# EAGLE design scartboard (EAGLE 6.0)
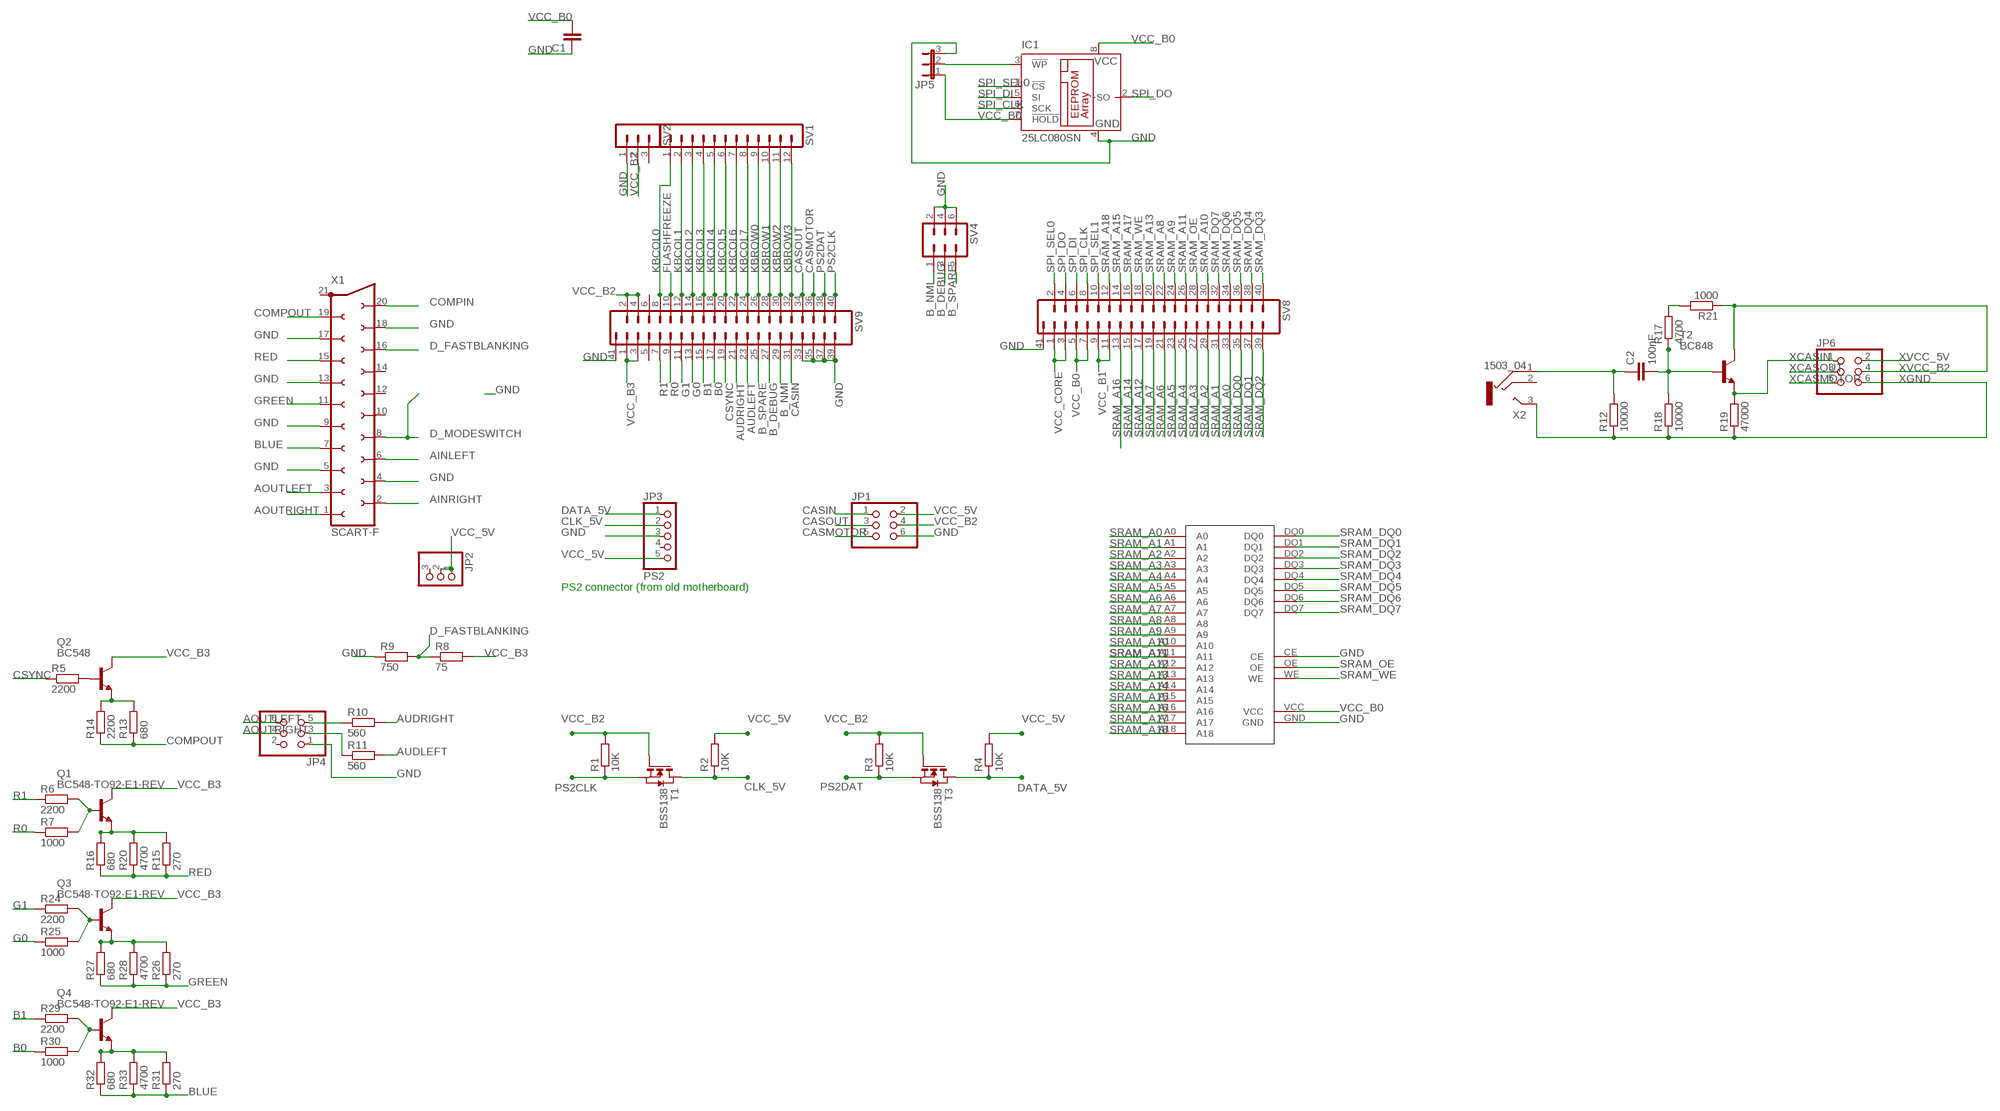
[diagram p0: schematic, sheet 1]

## Parts
C1  C-EUC0603  [C0603]
C2  100nF  C-EUC0603  [C0603]
IC1  25LC080SN  [SO-08]
JP1  PINHD-2X3  [2X03]
JP2  PINHD-1X3  [1X03]
JP3  PS2  PINHD-1X5  [1X05]
JP4  PINHD-2X3  [2X03]
JP5  JP2E  [JP2]
JP6  PINHD-2X3  [2X03]
Q1  BC548-TO92-E1-REV  [TO92-E1-REV]
Q2  BC548  [TO92-EBC]
Q3  BC548-TO92-E1-REV  [TO92-E1-REV]
Q4  BC548-TO92-E1-REV  [TO92-E1-REV]
R1  10K  R-EU_R0805  [R0805]
R2  10K  R-EU_R0805  [R0805]
R3  10K  R-EU_R0805  [R0805]
R4  10K  R-EU_R0805  [R0805]
R5  2200  R-EU_R0805  [R0805]
R6  2200  R-EU_R0805  [R0805]
R7  1000  R-EU_R0805  [R0805]
R8  75  R-EU_R0805  [R0805]
R9  750  R-EU_R0805  [R0805]
R10  560  R-EU_R0805  [R0805]
R11  560  R-EU_R0805  [R0805]
R12  10000  R-EU_R0805  [R0805]
R13  680  R-EU_R0805  [R0805]
R14  2200  R-EU_R0805  [R0805]
R15  270  R-EU_R0805  [R0805]
R16  680  R-EU_R0805  [R0805]
R17  4700  R-EU_R0805  [R0805]
R18  10000  R-EU_R0805  [R0805]
R19  47000  R-EU_R0805  [R0805]
R20  4700  R-EU_R0805  [R0805]
R21  1000  R-EU_R0805  [R0805]
R24  2200  R-EU_R0805  [R0805]
R25  1000  R-EU_R0805  [R0805]
R26  270  R-EU_R0805  [R0805]
R27  680  R-EU_R0805  [R0805]
R28  4700  R-EU_R0805  [R0805]
R29  2200  R-EU_R0805  [R0805]
R30  1000  R-EU_R0805  [R0805]
R31  270  R-EU_R0805  [R0805]
R32  680  R-EU_R0805  [R0805]
R33  4700  R-EU_R0805  [R0805]
SV1  MA12-1  [MA12-1]
SV2  MA03-1  [MA03-1]
SV4  MA03-2  [MA03-2]
SV8  ACTEL_HDR  [ACTEL_HDR]
SV9  ACTEL_HDR  [ACTEL_HDR]
T1  BSS138  NMOSSOT23  [SOT-23]
T2  BC848  [SOT23]
T3  BSS138  NMOSSOT23  [SOT-23]
U$1  AS6C4008  [SOP32]
X1  SCART-F  [SCART-F]
X2  1503_04  [1503_04]

## Nets
AINLEFT: X1.6
AINRIGHT: X1.2
AOUTLEFT: JP4.6 X1.3
AOUTRIGHT: JP4.4 X1.1
AUDLEFT: R11.2 SV9.23
AUDRIGHT: R10.2 SV9.21
B0: R30.1 SV9.17
B1: R29.1 SV9.15
B_DEBUG: SV4.3 SV9.27
B_NMI: SV4.1 SV9.29
B_SPARE: SV4.5 SV9.25
BLUE: R31.1 R32.1 R33.1 X1.7
CASIN: JP1.1 SV9.31
CASMOTOR: JP1.5 SV9.36
CASOUT: JP1.3 SV9.34
CLK_5V: JP3.2 R2.1 T1.1(D)
COMPIN: X1.20
COMPOUT: R13.1 R14.1 X1.19
CSYNC: R5.1 SV9.19
D_FASTBLANKING: R8.1 R9.2 X1.16
D_MODESWITCH: X1.8
DATA_5V: JP3.1 R4.1 T3.1(D)
FLASHFREEZE: SV9.10
G0: R25.1 SV9.13
G1: R24.1 SV9.11
GND: C1.1 IC1.4(GND) JP1.6 JP3.3 JP4.1 JP5.3 R9.1 SV2.1 SV4.2 SV4.4 SV4.6 SV8.41 SV9.33 SV9.35 SV9.37 SV9.39 SV9.41 U$1.CE U$1.GND X1.4 X1.5 X1.9 X1.13 X1.17 X1.18
GREEN: R26.1 R27.1 R28.1 X1.11
KBCOL0: SV1.1 SV9.8
KBCOL1: SV1.2 SV9.12
KBCOL2: SV1.3 SV9.14
KBCOL3: SV1.4 SV9.16
KBCOL4: SV1.5 SV9.18
KBCOL5: SV1.6 SV9.20
KBCOL6: SV1.7 SV9.22
KBCOL7: SV1.8 SV9.24
KBROW0: SV1.9 SV9.26
KBROW1: SV1.10 SV9.28
KBROW2: SV1.11 SV9.30
KBROW3: SV1.12 SV9.32
N$1: Q2.E R13.2 R14.2
N$2: Q1.2(B) R6.2 R7.2
N$3: Q2.B R5.2
N$4: JP4.5 R10.1
N$5: JP4.3 R11.1
N$6: Q1.3(E) R15.2 R16.2 R20.2
N$7: IC1.3(!WP) JP5.2
N$8: C2.2 R17.1 R18.2 T2.1(B)
N$9: Q3.2(B) R24.2 R25.2
N$10: Q3.3(E) R26.2 R27.2 R28.2
N$11: Q4.2(B) R29.2 R30.2
N$12: Q4.3(E) R31.2 R32.2 R33.2
N$13: R17.2 R21.2
N$14: C2.1 R12.2 X2.1
PS2CLK: R1.1 SV9.40 T1.2(S)
PS2DAT: R3.1 SV9.38 T3.2(S)
R0: R7.1 SV9.9
R1: R6.1 SV9.7
RED: R15.1 R16.1 R20.1 X1.15
SPI_CLK: IC1.6(SCK) SV8.8
SPI_DI: IC1.5(SI) SV8.6
SPI_DO: IC1.2(SO) SV8.4
SPI_SEL0: IC1.1(!CS) SV8.2
SPI_SEL1: SV8.10
SRAM_A0: SV8.33 U$1.A0
SRAM_A1: SV8.31 U$1.A1
SRAM_A2: SV8.29 U$1.A2
SRAM_A3: SV8.27 U$1.A3
SRAM_A4: SV8.25 U$1.A4
SRAM_A5: SV8.23 U$1.A5
SRAM_A6: SV8.21 U$1.A6
SRAM_A7: SV8.19 U$1.A7
SRAM_A8: SV8.22 U$1.A8
SRAM_A9: SV8.24 U$1.A9
SRAM_A10: SV8.30 U$1.A10
SRAM_A11: SV8.26 U$1.A11
SRAM_A12: SV8.17 U$1.A12
SRAM_A13: SV8.20 U$1.A13
SRAM_A14: SV8.15 U$1.A14
SRAM_A15: SV8.14 U$1.A15
SRAM_A16: SV8.13 U$1.A16
SRAM_A17: SV8.16 U$1.A17
SRAM_A18: SV8.12 U$1.A18
SRAM_DQ0: SV8.35 U$1.DQ0
SRAM_DQ1: SV8.37 U$1.DQ1
SRAM_DQ2: SV8.39 U$1.DQ2
SRAM_DQ3: SV8.40 U$1.DQ3
SRAM_DQ4: SV8.38 U$1.DQ4
SRAM_DQ5: SV8.36 U$1.DQ5
SRAM_DQ6: SV8.34 U$1.DQ6
SRAM_DQ7: SV8.32 U$1.DQ7
SRAM_OE: SV8.28 U$1.OE
SRAM_WE: SV8.18 U$1.WE
VCC_5V [power]: JP1.2 JP2.1 JP2.2 JP3.5 R2.2 R4.2
VCC_B0: C1.2 IC1.7(!HOLD) IC1.8(VCC) JP5.1 SV8.5 SV8.7 U$1.VCC
VCC_B1: SV8.9 SV8.11
VCC_B2: JP1.4 R1.2 R3.2 SV2.2 SV9.2 SV9.4 T1.3(G) T3.3(G)
VCC_B3: Q1.1(C) Q2.C Q3.1(C) Q4.1(C) R8.2 SV9.1 SV9.3
VCC_CORE: SV8.1 SV8.3
XCASIN: JP6.1 R19.2 T2.2(E)
XCASMOTOR: JP6.5
XCASOUT: JP6.3
XGND: JP6.6 R12.1 R18.1 R19.1 X2.3
XVCC_5V: JP6.2
XVCC_B2: JP6.4 R21.1 T2.3(C)
Unconnected: JP2.3 JP3.4 JP4.2 SV2.3 SV9.5 SV9.6 X1.10 X1.12 X1.14 X1.21 X2.2

## Notes on the sheet
- PS2 connector (from old motherboard)

## Library data of the parts
C1 = rcl:C-EU: CAPACITOR, European symbol
C2 = resistor:C-EU: CAPACITOR, European symbol
IC1 = microchip:25*: Serial EEPROM 4K/ 8K , SPI bus; MF: MICROCHIP; MPN: 25LC080/SN; OC_FARNELL: 1137302; OC_NEWARK: 96K4092
JP1 JP4 JP6 = pinhead:PINHD-2X3: PIN HEADER
JP2 = pinhead:PINHD-1X3: PIN HEADER
JP3 = pinhead:PINHD-1X5: PIN HEADER
JP5 = jumper:JP2E: JUMPER
Q1 Q3 Q4 = bc548:BC548*: NPN Transistor
Q2 = transistor-npn:BC548*: NPN Transistor
R1-R21 R24-R33 = rcl:R-EU_: RESISTOR, European symbol
SV1 = con-lstb:MA12-1: PIN HEADER; OC_FARNELL: unknown; OC_NEWARK: unknown
SV2 = con-lstb:MA03-1: PIN HEADER; OC_FARNELL: unknown; OC_NEWARK: unknown
SV4 = con-lstb:MA03-2: PIN HEADER; OC_FARNELL: unknown; OC_NEWARK: unknown
SV8 SV9 = cpcfpga:ACTEL_HDR: PIN HEADER; OC_FARNELL: unknown; OC_NEWARK: unknown
T1 T3 = zetex:NMOSSOT23: MOS FET; OC_FARNELL: unknown; OC_NEWARK: unknown
T2 = transistor:BC848: NPN TRANSISTOR
U$1 = sram:AS6C4008: AS6C4008 static ram
X1 = con-hirschmann:SCART-F: TV SCART CONNECTOR; OC_FARNELL: unknown; OC_NEWARK: unknown
X2 = con-lumberg:1503_04: Jack connectors according to JISC 6560, 3.5 mm, IP 57 Klinkensteckverbinder nach JISC 6560, 3,5 mm, IP 57 Source: http://www.lumberg.com/Produkte/PDFs/1503_04.pdf; OC_FARNELL: 1216981; OC_NEWARK: unknown

## Net classes
0 default: width 0.2 mm, drill 1.1 mm, clearance 0.2 mm
1 power: width 0.6 mm, drill 1.1 mm, clearance 0.4 mm

## Board
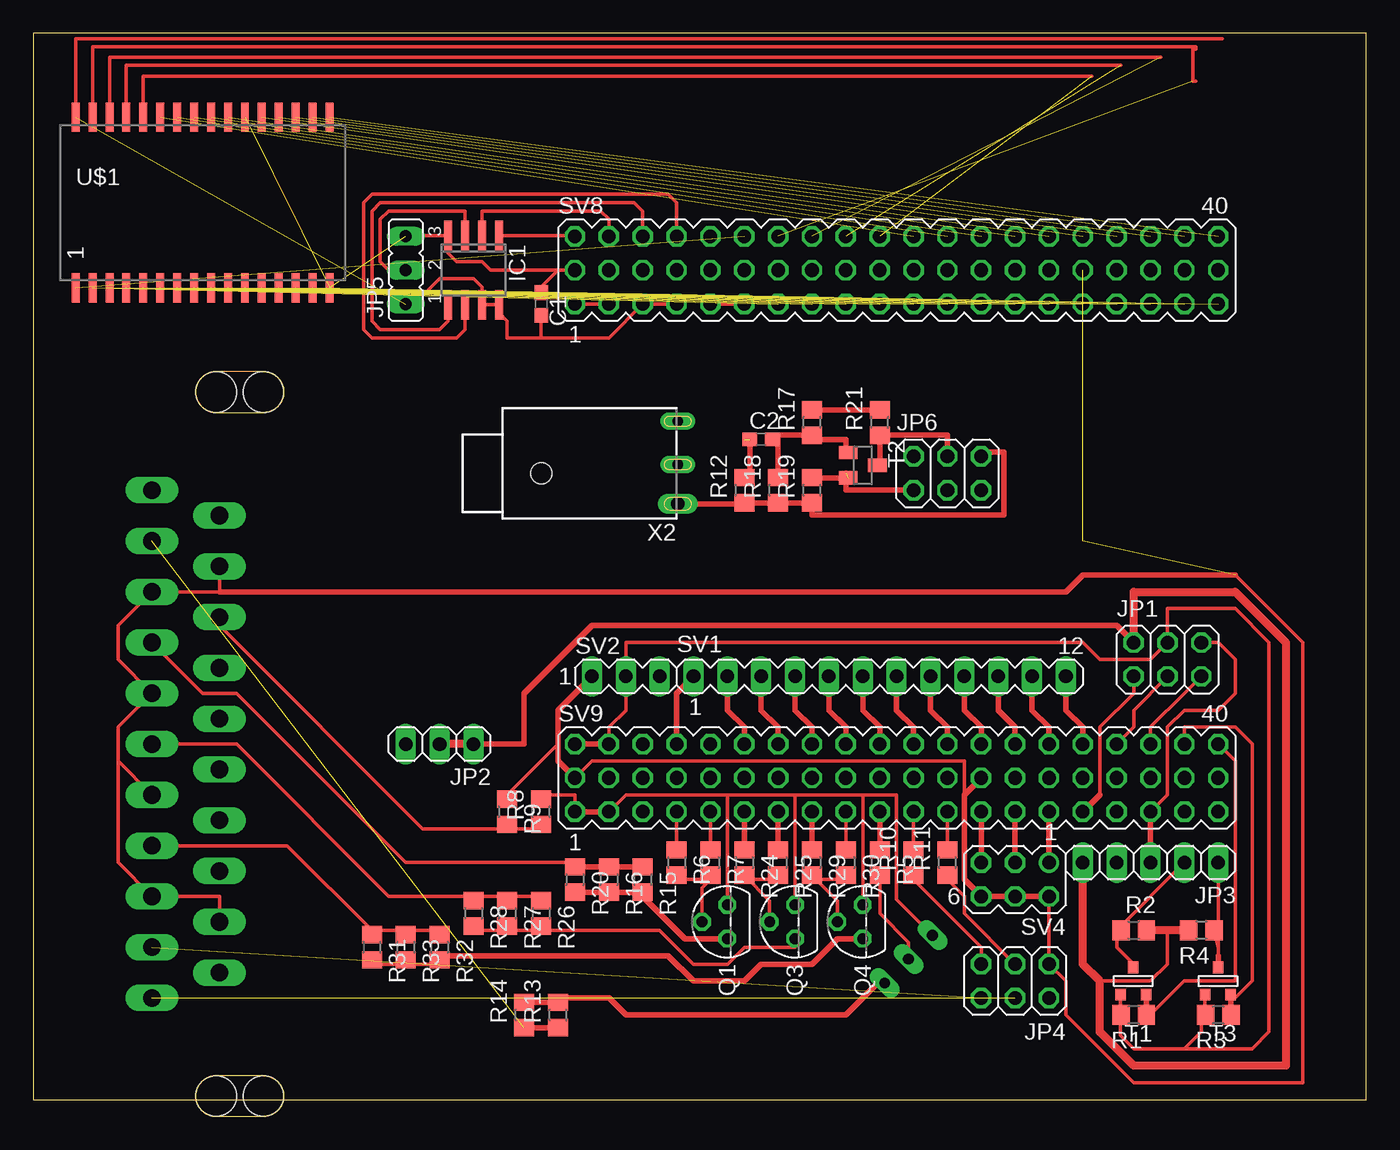
[diagram p1: board, top side]
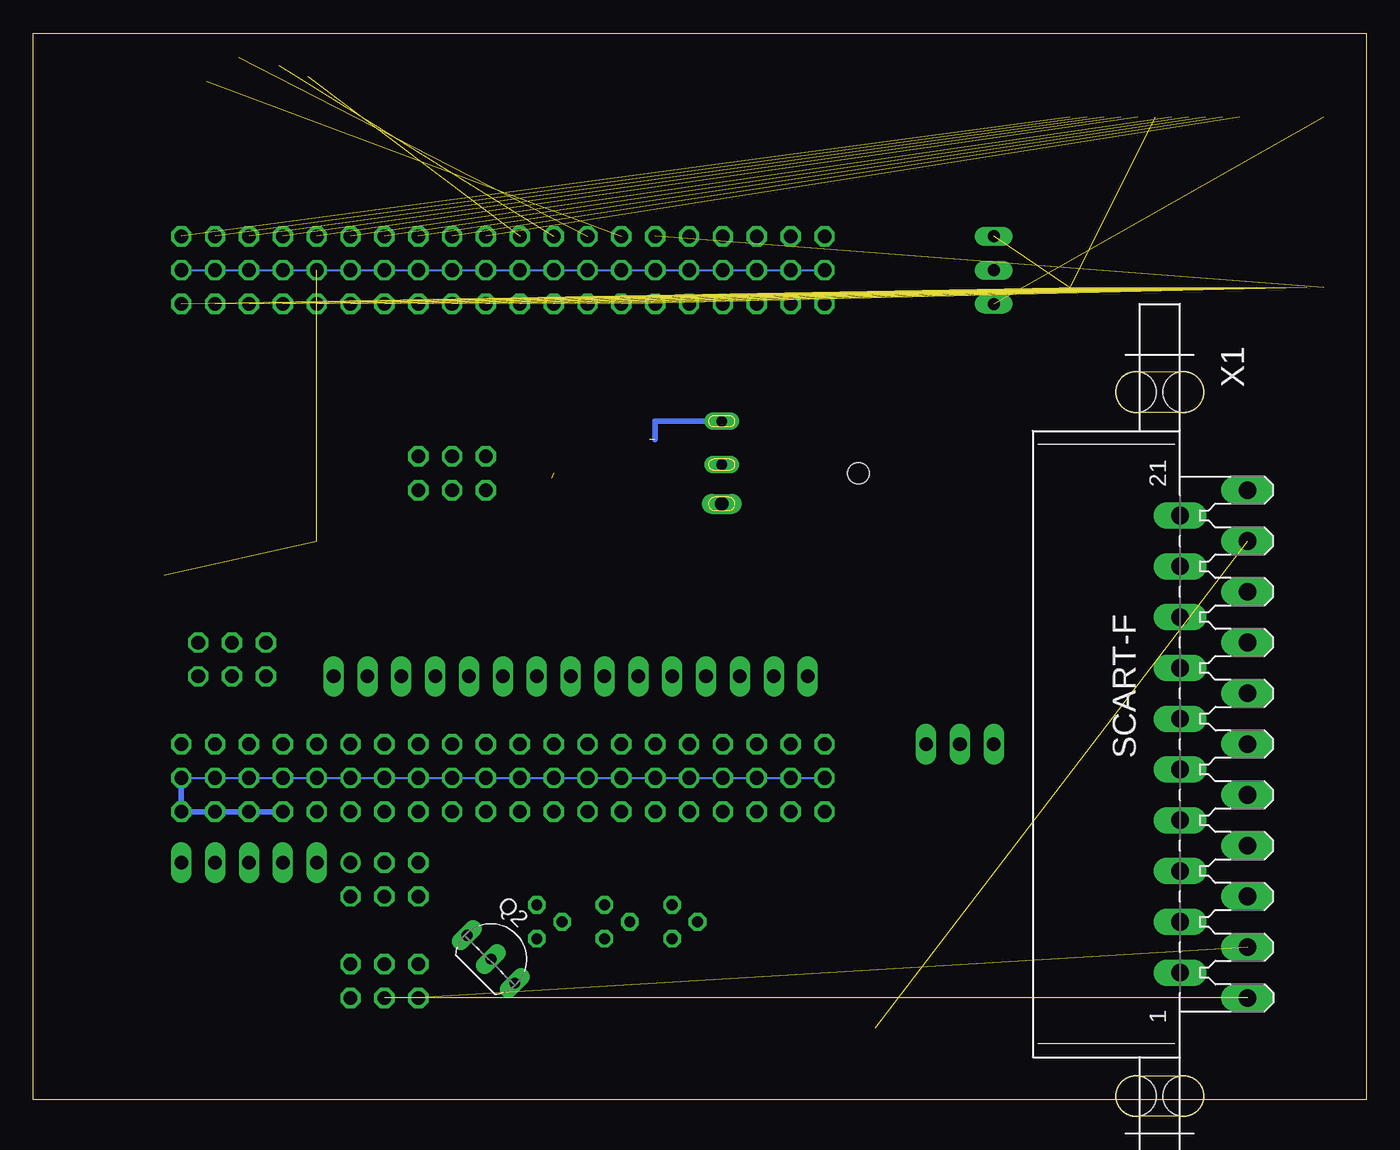
[diagram p2: board, bottom side, seen from below]

Size 100 x 80 mm. Coordinates in mm from the lower left corner, seen from the top.
Outline: 0,0 100,0 100,80 0,80 0,0
Copper layers (1*16): Top 0.035mm / dielectric 1.5mm / Bottom 0.035mm
Design rules: minimum track width 10mil, minimum drill 24mil, track to track 8mil, track to pad 8mil, pad to pad 8mil, via to via 8mil, smd to smd 8mil, copper to edge 40mil, drill to drill 8mil, minimum pad ring 10mil, minimum via ring 8mil, stop-mask expansion 4mil, vias tented up to drill 0mil, thermal gap 10mil

### Footprints (pad centres in the part's own frame; a part is rotated, then mirrored left to right if it is on the bottom)
C0603 = smd 1.1 x 1: 1 -0.85,0; 2 0.85,0
SO-08 = smd 0.6 x 2.2: 1 -1.905,-2.6; 2 -0.635,-2.6; 3 0.635,-2.6; 4 1.905,-2.6; 5 1.905,2.6; 6 0.635,2.6; 7 -0.635,2.6; 8 -1.905,2.6
2X03 = drill 1.016 octagon: 1 -2.54,-1.27; 2 -2.54,1.27; 3 0,-1.27; 4 0,1.27; 5 2.54,-1.27; 6 2.54,1.27
1X03 = drill 1.016 long: 1 -2.54,0; 2 0,0; 3 2.54,0
1X05 = drill 1.016 long: 1 -5.08,0; 2 -2.54,0; 3 0,0; 4 2.54,0; 5 5.08,0
JP2 = drill 0.914 long: 1 -2.54,0; 2 0,0; 3 2.54,0
TO92-E1-REV = drill 0.813 octagon: 1 -1.27,0; 2 0,-1.905; 3 1.27,0
TO92-EBC = drill 0.813 long: B 0,-1.27; C -2.54,-1.27; E 2.54,-1.27
R0805 = smd 1.3 x 1.5: 1 -0.95,0; 2 0.95,0
MA12-1 = drill 1.016 long: 1 -13.97,0; 2 -11.43,0; 3 -8.89,0; 4 -6.35,0; 5 -3.81,0; 6 -1.27,0; 7 1.27,0; 8 3.81,0; 9 6.35,0; 10 8.89,0; 11 11.43,0; 12 13.97,0
MA03-1 = drill 1.016 long: 1 -2.54,0; 2 0,0; 3 2.54,0
MA03-2 = drill 1.016: 1 -2.54,-1.27 | drill 1.016 octagon: 2 -2.54,1.27; 3 0,-1.27; 4 0,1.27; 5 2.54,-1.27; 6 2.54,1.27
ACTEL_HDR = drill 1.016 octagon: 1 -24.13,-2.54; 2 -24.13,2.54; 3 -21.59,-2.54; 4 -21.59,2.54; 5 -19.05,-2.54; 6 -19.05,2.54; 7 -16.51,-2.54; 8 -16.51,2.54; 9 -13.97,-2.54; 10 -13.97,2.54; 11 -11.43,-2.54; 12 -11.43,2.54; 13 -8.89,-2.54; 14 -8.89,2.54; 15 -6.35,-2.54; 16 -6.35,2.54; 17 -3.81,-2.54; 18 -3.81,2.54; 19 -1.27,-2.54; 20 -1.27,2.54; 21 1.27,-2.54; 22 1.27,2.54; 23 3.81,-2.54; 24 3.81,2.54; 25 6.35,-2.54; 26 6.35,2.54; 27 8.89,-2.54; 28 8.89,2.54; 29 11.43,-2.54; 30 11.43,2.54; 31 13.97,-2.54; 32 13.97,2.54; 33 16.51,-2.54; 34 16.51,2.54; 35 19.05,-2.54; 36 19.05,2.54; 37 21.59,-2.54; 38 21.59,2.54; 39 24.13,-2.54; 40 24.13,2.54; 41 -24.13,0; 42 -21.59,0; 43 -19.05,0; 44 -16.51,0; 45 -13.97,0; 46 -11.43,0; 47 -8.89,0; 48 -6.35,0; 49 -3.81,0; 50 -1.27,0; 51 1.27,0; 52 3.81,0; 53 6.35,0; 54 8.89,0; 55 11.43,0; 56 13.97,0; 57 16.51,0; 58 19.05,0; 59 21.59,0; 60 24.13,0
SOT-23 = smd 0.787 x 0.889: 1 0.025,-1.016; 2 -0.94,1.016; 3 0.991,1.016
SOT23 = smd 1 x 1.4: 1 -0.95,-1.1; 2 0.95,-1.1; 3 0,1.1
SOP32 = smd 0.6 x 2.2: A0 4.445,-6.4; A1 3.175,-6.4; A2 1.905,-6.4; A3 0.635,-6.4; A4 -0.635,-6.4; A5 -1.905,-6.4; A6 -3.175,-6.4; A7 -4.445,-6.4; A8 -3.175,6.4; A9 -1.905,6.4; A10 1.905,6.4; A11 -0.635,6.4; A12 -5.715,-6.4; A13 -4.445,6.4; A14 -6.985,-6.4; A15 -8.255,6.4; A16 -8.255,-6.4; A17 -6.985,6.4; A18 -9.525,-6.4; CE 3.175,6.4; DQ0 5.715,-6.4; DQ1 6.985,-6.4; DQ2 8.255,-6.4; DQ3 9.525,6.4; DQ4 8.255,6.4; DQ5 6.985,6.4; DQ6 5.715,6.4; DQ7 4.445,6.4; GND 9.525,-6.4; OE 0.635,6.4; VCC -9.525,6.4; WE -5.715,6.4
SCART-F = drill 1.321 long: 1 19.05,5.08; 2 17.145,0; 3 15.24,5.08; 4 13.335,0; 5 11.43,5.08; 6 9.525,0; 7 7.62,5.08; 8 5.715,0; 9 3.81,5.08; 10 1.905,0; 11 0,5.08; 12 -1.905,0; 13 -3.81,5.08; 14 -5.715,0; 15 -7.62,5.08; 16 -9.525,0; 17 -11.43,5.08; 18 -13.335,0; 19 -15.24,5.08; 20 -17.145,0; 21 -19.05,5.08 | hole 3.023: 26.416,0.254; 26.416,-3.302; -26.416,0.254; -26.416,-3.302
1503_04 = drill 0.8 pad 1.2 long: 1 3.9,-10.25; 2 0.65,-10.25 | drill 1 pad 1.2 long: 3 -2.3,-10.25 | hole 1.6: 0,0

### Placement (x,y rotation side)
C1  38.1,59.69 270 top
C2  54.61,49.53 0 top
IC1  33.02,62.23 180 top
JP1  85.09,33.02 0 top
JP2  30.48,26.67 180 top
JP3  83.82,17.78 180 top
JP4  73.66,8.89 180 top
JP5  27.94,62.23 90 top
JP6  68.58,46.99 0 top
Q1  52.07,13.34 270 top
Q2  64.77,11.43 315 bottom
Q3  57.15,13.34 270 top
Q4  62.23,13.34 270 top
R1  82.55,6.35 180 top
R2  82.55,12.7 0 top
R3  88.9,6.35 180 top
R4  87.63,12.7 180 top
R5  63.5,17.78 270 top
R6  48.26,17.78 270 top
R7  50.8,17.78 270 top
R8  38.1,21.59 90 top
R9  35.56,21.59 270 top
R10  66.04,17.78 90 top
R11  68.58,17.78 90 top
R12  53.34,45.72 90 top
R13  39.37,6.35 90 top
R14  36.83,6.35 90 top
R15  45.72,16.51 270 top
R16  43.18,16.51 270 top
R17  58.42,50.8 90 top
R18  55.88,45.72 90 top
R19  58.42,45.72 90 top
R20  40.64,16.51 270 top
R21  63.5,50.8 90 top
R24  53.34,17.78 270 top
R25  55.88,17.78 270 top
R26  38.1,13.97 270 top
R27  35.56,13.97 270 top
R28  33.02,13.97 270 top
R29  58.42,17.78 270 top
R30  60.96,17.78 270 top
R31  25.4,11.43 270 top
R32  30.48,11.43 270 top
R33  27.94,11.43 270 top
SV1  63.5,31.75 0 top
SV2  44.45,31.75 0 top
SV4  73.66,16.51 180 top
SV8  64.77,62.23 0 top
SV9  64.77,24.13 0 top
T1  82.55,8.89 180 top
T2  62.23,47.59 270 top
T3  88.9,8.89 180 top
U$1  12.7,67.31 0 top
X1  13.97,26.67 270 bottom
X2  38.1,46.99 90 top

### Tracks (layer width: path | path; a pad name or v marks a point on that pad's centre or on a via)
AOUTLEFT  (1 unrouted)
AOUTRIGHT  (1 unrouted)
AUDLEFT
  Top 0.254: SV9.23 R11.2
AUDRIGHT
  Top 0.254: SV9.21 R10.2
B0
  Top 0.254: SV9.17 R30.1
B1
  Top 0.254: 58.42,19.05 R29.1
  Top 0.406: 58.42,19.05 SV9.15
B_DEBUG
  Top 0.406: SV9.27 SV4.3
B_NMI
  Top 0.406: SV4.1 SV9.29
B_SPARE
  Top 0.406: SV4.5 SV9.25
BLUE
  Top 0.254: 27.94,12.7 25.4,12.7 | 27.94,12.7 30.48,12.7 R32.1 | 27.94,12.7 R33.1 | 25.4,12.7 19.05,19.05 X1.7 | 25.4,12.7 R31.1
CASIN
  Top 0.254: 80.01,22.86 80.01,27.94 82.55,30.48 JP1.1
  Top 0.406: SV9.31 80.01,22.86
CASMOTOR
  Top 0.254: JP1.5 87,31.11 86.36,30.48 83.82,27.94 SV9.36
CASOUT
  Top 0.254: SV9.34 82.55,27.94 82.55,29.21 JP1.3
CLK_5V
  Top 0.254: 81.28,12.7 81.28,11.43 82.55,10.16 T1.1 | JP3.2 81.28,12.7 | 81.28,12.7 R2.1
COMPOUT  (1 unrouted)
  Top 0.406: R13.1 R14.1
CSYNC
  Top 0.406: R5.1 SV9.19
D_FASTBLANKING
  Top 0.254: 13.97,36.83 X1.16 13.97,35.56 29.21,20.32 35.56,20.32 | 35.56,20.32 38.1,20.32 R8.1 | 35.56,20.32 R9.2
DATA_5V
  Top 0.254: 88.9,11.43 88.9,10.16 T3.1 | JP3.1 88.9,11.43 | 88.9,11.43 R4.1
  Top 0.406: T3.1 88.9,9.93 88.9,10.16 88.9,10.79
G0
  Top 0.406: SV9.13 R25.1
G1
  Top 0.406: SV9.11 R24.1
GND  (5 unrouted)
  Top 0.254: SV9.41 41.91,25.4 69.85,25.4 69.85,22.86 | SV4.2 JP4.1 77.47,8.89 77.47,6.35 82.55,1.27 95.25,1.27 95.25,34.29 90.17,39.37 | X1.4 13.97,15.24 X1.5 6.35,17.78 6.35,25.4 | 6.35,25.4 X1.9 | 39.37,26.67 35.56,22.86 R9.1 | 13.97,40.64 X1.18 13.97,38.1 X1.17 6.35,35.56 6.35,33.02 X1.13 6.35,27.94 6.35,25.4 | JP1.6 88.9,34.29 90.17,33.02 90.17,30.48 88.9,29.21 86.36,29.21 85.09,27.94 85.09,22.86 SV9.35 | 39.37,62.23 34.29,62.23 33.66,62.87 31.75,62.87 31.11,63.5 IC1.4 28,64.83 JP5.3 | 39.37,62.23 SV8.41 | C1.1 38.1,60.96 39.37,62.23
  Top 0.406: SV2.1 39.37,29.21 39.37,26.67 39.37,25.4 SV9.41 | JP3.3 SV9.35 | 71.12,24.13 69.85,22.86 69.85,16.51 SV4.6 SV4.4 SV4.2 | 13.97,38.1 77.47,38.1 78.74,39.37 90.17,39.37
  Bottom 0.406: SV9.33 SV9.35 SV9.37 SV9.39 88.9,24.13
GREEN
  Top 0.254: 35.56,15.24 33.02,15.24 | 35.56,15.24 38.1,15.24 R26.1 | 35.56,15.24 R27.1 | X1.11 15.24,26.67 26.67,15.24 33.02,15.24 | 33.02,15.24 R28.1
KBCOL0
  Top 0.406: SV9.8 48.26,30.48 SV1.1
KBCOL1
  Top 0.406: SV1.2 52.07,29.21 53.34,27.94 SV9.12
KBCOL2
  Top 0.406: SV9.14 55.88,27.94 54.61,29.21 SV1.3
KBCOL3
  Top 0.406: SV9.16 58.42,27.94 57.15,29.21 SV1.4
KBCOL4
  Top 0.406: SV9.18 60.96,27.94 59.69,29.21 SV1.5
KBCOL5
  Top 0.406: SV9.20 63.5,27.94 62.23,29.21 SV1.6
KBCOL6
  Top 0.406: SV9.22 66.04,27.94 64.77,29.21 SV1.7
KBCOL7
  Top 0.406: SV9.24 68.58,27.94 67.31,29.21 SV1.8
KBROW0
  Top 0.406: SV9.26 71.12,27.94 69.85,29.21 SV1.9
KBROW1
  Top 0.406: SV9.28 73.66,27.94 72.39,29.21 SV1.10
KBROW2
  Top 0.406: SV9.30 76.2,27.94 74.93,29.21 SV1.11
KBROW3
  Top 0.406: SV9.32 78.74,27.94 77.47,29.21 SV1.12
N$1
  Top 0.406: Q2.E 63.35,8.74 60.96,6.35 44.45,6.35 43.18,7.62 39.69,7.62 R13.2 R14.2
N$2
  Top 0.254: Q1.2 50.16,15.88 50.8,16.51 | 50.8,16.51 48.26,16.51 R6.2 | 50.8,16.51 R7.2
  Top 0.406: 47.94,16.51 R6.2
N$3
  Top 0.254: Q2.B 65.67,11.8 63.5,13.97 R5.2
N$4
  Top 0.254: JP4.5 71.12,11.43 66.04,16.51 R10.1
N$5
  Top 0.254: JP4.3 69.85,13.97 69.85,15.24 68.58,16.51 R11.1
N$6
  Top 0.406: Q1.3 48.9,12.06 45.72,15.24 R15.2 R16.2 R20.2
N$7
  Top 0.254: JP5.2 26.67,62.23 26.04,62.87 26.04,66.04 26.67,66.67 32.38,66.67 IC1.3
N$8
  Top 0.406: T2.1 60.96,48.54 60.96,49.53 58.42,49.53 R17.1 55.46,49.85 C2.2 55.88,49.53 R18.2
N$9
  Top 0.254: Q3.2 55.24,14.93 R24.2 53.34,16.51 55.88,16.51 R25.2
N$10
  Top 0.254: 35.56,12.7 33.02,12.7 R28.2 | 35.56,12.7 38.1,12.7 | 35.56,12.7 R27.2 | 38.1,12.7 46.99,12.7 49.53,10.16 52.07,10.16 53.34,11.43 57.15,11.43 Q3.3 | 38.1,12.7 R26.2
N$11
  Top 0.254: Q4.2 60.33,14.93 R29.2 58.42,16.51 60.96,16.51 R30.2
N$12
  Top 0.254: 27.94,10.16 25.4,10.16 R31.2 | 27.94,10.16 30.48,10.16 R32.2 | 27.94,10.16 R33.2
  Top 0.406: Q4.3 60.33,12.06 58.42,10.16 54.61,10.16 53.34,8.89 49.53,8.89 47.62,10.79 30.8,10.79 R32.2
N$13
  Top 0.406: R17.2 R21.2
N$14  (1 unrouted)
  Top 0.406: R12.2 53.76,46.67 C2.1
  Bottom 0.406: X2.1 53.34,50.89 53.34,49.53
PS2CLK
  Top 0.254: R1.1 83.82,6.35 86.36,8.89 90.17,8.89 90.17,25.4 SV9.40
  Top 0.406: T1.2 R1.1
PS2DAT
  Top 0.254: SV9.38 86.36,27.94 90.17,27.94 91.44,26.67 91.44,8.89 90.17,7.62 T3.2
  Top 0.406: R3.1 T3.2
R0
  Top 0.254: SV9.9 R7.1
R1
  Top 0.254: SV9.7 R6.1
RED
  Top 0.254: X1.15 12.7,30.48 15.24,30.48 27.94,17.78 40.64,17.78 R20.1
  Top 0.406: R16.1 43.18,17.78 | R16.1 R15.1 | R16.1 R20.1
SPI_CLK
  Top 0.254: SV8.8 48.26,67.31 47.62,67.94 25.4,67.94 24.77,67.31 24.77,57.78 25.4,57.15 31.75,57.15 32.38,57.78 IC1.6 32.38,59.69
SPI_DI
  Top 0.254: SV8.6 45.72,66.67 45.09,67.31 26.04,67.31 25.4,66.67 25.4,58.42 26.04,57.78 30.48,57.78 31.11,58.42 IC1.5 31.11,59.69
SPI_DO
  Top 0.254: IC1.2 33.66,66.67 42.55,66.67 43.18,66.04 SV8.4
SPI_SEL0
  Top 0.254: IC1.1 40.58,64.83 SV8.2
SRAM_A0  (1 unrouted)
SRAM_A1  (1 unrouted)
SRAM_A2  (1 unrouted)
SRAM_A3  (1 unrouted)
SRAM_A4  (1 unrouted)
SRAM_A5  (1 unrouted)
SRAM_A6  (1 unrouted)
SRAM_A7  (1 unrouted)
SRAM_A8  (1 unrouted)
SRAM_A9  (1 unrouted)
SRAM_A10  (1 unrouted)
SRAM_A11  (1 unrouted)
SRAM_A12  (1 unrouted)
SRAM_A13  (1 unrouted)
  Top 0.254: U$1.A13 8.26,76.8 79.4,76.8
SRAM_A14  (1 unrouted)
SRAM_A15  (1 unrouted)
  Top 0.254: U$1.A15 4.45,79 87,79 | 87,79 87.2,79 87.2,78.8 87,78.8 | 87,78.8 87,79 | 87,78.8 87,76.4 87.2,76.4
SRAM_A16  (1 unrouted)
SRAM_A17  (1 unrouted)
  Top 0.254: U$1.A17 5.71,78.2 84.6,78.2
SRAM_A18  (1 unrouted)
SRAM_DQ0  (1 unrouted)
SRAM_DQ1  (1 unrouted)
SRAM_DQ2  (1 unrouted)
SRAM_DQ3  (1 unrouted)
SRAM_DQ4  (1 unrouted)
SRAM_DQ5  (1 unrouted)
SRAM_DQ6  (1 unrouted)
SRAM_DQ7  (1 unrouted)
SRAM_OE  (1 unrouted)
SRAM_WE  (1 unrouted)
  Top 0.254: U$1.WE 6.99,77.6 81.6,77.6
VCC_5V
  Top 0.254: 80.01,8.89 83.82,8.89 85.09,10.16 85.09,12.7
  Top 0.406: JP2.1 36.83,26.67 36.83,30.48 41.91,35.56 81.28,35.56 JP1.2
  Top 0.6: JP1.2 82.55,38.1 90.17,38.1 93.98,34.29 93.98,2.54 82.55,2.54 80.01,5.08 80.01,8.89 78.74,10.16 JP3.5 | R4.2 85.09,12.7 R2.2 | JP2.1 JP2.2
VCC_B0  (1 unrouted)
  Top 0.254: SV8.7 SV8.5 43.18,57.15 38.1,57.15 | 38.1,57.15 35.56,57.15 35.56,58.42 34.92,59.05 IC1.8 IC1.7 33.66,60.96 33.02,61.59 30.48,61.59 28.57,59.69 JP5.1 | C1.2 38.1,57.15 | U$1.VCC 3.17,79.6 89.2,79.6
VCC_B1
  Top 0.254: SV8.11 SV8.9
VCC_B2
  Top 0.254: R1.2 81.56,6.39 T1.3 81.56,4.8 82.55,3.81 86.36,3.81 | T3.3 87.91,6.39 R3.2 87.63,6.03 87.63,5.08 86.36,3.81 | 86.36,3.81 91.44,3.81 92.71,5.08 92.71,34.29 90.17,36.83 85.09,36.83 JP1.4 83.82,33.02 80.01,33.02 78.74,34.29 44.45,34.29 SV2.2 44.45,29.21 43.18,27.94 SV9.4
  Top 0.406: SV9.4 SV9.2
VCC_B3
  Top 0.254: SV9.1 40.64,22.86 38.1,22.86 R8.2 | SV9.3 44.45,22.86 52.07,22.86 | Q1.1 52.07,22.86 | Q3.1 57.15,22.86 | 57.15,22.86 52.07,22.86 | 62.23,22.86 57.15,22.86 | Q4.1 62.23,22.86 | 62.23,22.86 64.77,22.86 64.77,15.02 Q2.C
  Top 0.406: SV9.3 SV9.1
VCC_CORE
  Top 0.254: SV8.3 SV8.1
XCASIN  (1 unrouted)
  Top 0.406: JP6.1 60.96,45.72 60.96,46.99 | T2.2 58.42,46.64 R19.2
XGND
  Top 0.406: X2.3 53.34,44.69 R12.1 R18.1 R19.1 58.4,44.77 58.4,43.87 72.8,43.87 72.8,48.6 71.12,48.6 JP6.6
XVCC_B2
  Top 0.406: JP6.4 68.58,49.85 R21.1 63.5,47.59 T2.3